# EAGLE design pic socket (EAGLE 9.6.1)
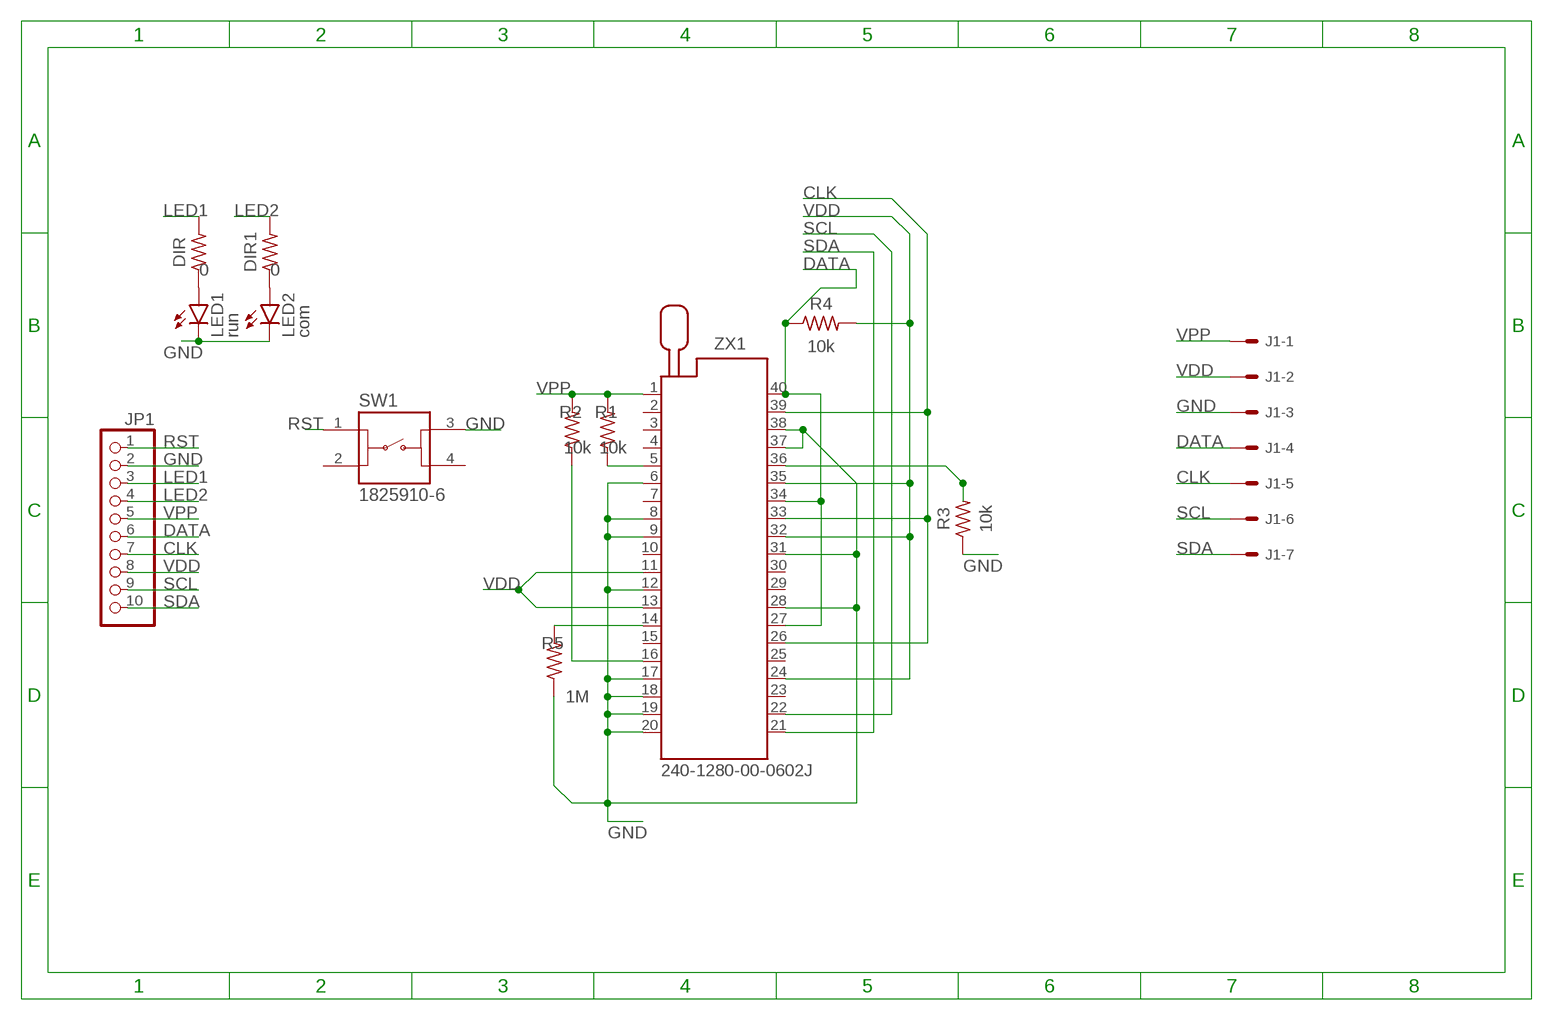
[diagram p0: schematic, sheet 1]

## Parts
DIR  0  R-US_CHIP-1206(3216-METRIC)  [RESC3216X70]
DIR1  0  R-US_CHIP-1206(3216-METRIC)  [RESC3216X70]
J1  22-05-7078-07  [7395-07]
JP1  PINHD-1X10  [1X10]
LED1  run  LEDSMT1206  [1206]
LED2  com  LEDSMT1206  [1206]
R1  10k  R-US_CHIP-1206(3216-METRIC)  [RESC3216X70]
R2  10k  R-US_CHIP-1206(3216-METRIC)  [RESC3216X70]
R3  10k  R-US_CHIP-1206(3216-METRIC)  [RESC3216X70]
R4  10k  R-US_CHIP-1206(3216-METRIC)  [RESC3216X70]
R5  1M  R-US_CHIP-1206(3216-METRIC)  [RESC3216X70]
SW1  1825910-6  [1825910-6]
ZX1  240-1280-00-0602J  [240-1280-00-0602J]

## Nets
CLK: J1.5 JP1.7 ZX1.26 ZX1.33 ZX1.39
DATA: J1.4 JP1.6 R4.1 ZX1.27 ZX1.34 ZX1.40
GND: J1.3 JP1.2 LED1.C LED2.C R3.1 R5.1 SW1.3 ZX1.6 ZX1.8 ZX1.9 ZX1.12 ZX1.17 ZX1.18 ZX1.19 ZX1.20 ZX1.28 ZX1.31 ZX1.37 ZX1.38
LED1: DIR.2 JP1.3
LED2: DIR1.2 JP1.4
N$1: R3.2 ZX1.36
N$2: R1.1 ZX1.5
N$3: R2.1 ZX1.16
N$4: R5.2 ZX1.14
N$5: DIR.1 LED1.A
N$6: DIR1.1 LED2.A
RST: JP1.1 SW1.1
SCL: J1.6 JP1.9 ZX1.22
SDA: J1.7 JP1.10 ZX1.21
VDD: J1.2 JP1.8 R4.2 ZX1.11 ZX1.13 ZX1.24 ZX1.32 ZX1.35
VPP: J1.1 JP1.5 R1.2 R2.2 ZX1.1
Unconnected: SW1.2 SW1.4 ZX1.2 ZX1.3 ZX1.4 ZX1.7 ZX1.10 ZX1.15 ZX1.23 ZX1.25 ZX1.29 ZX1.30

## Library data of the parts
DIR DIR1 R1-R5 = Resistor:R-US: Resistor Fixed - ANSI; CATEGORY: Resistor; SUB-CATEGORY: Fixed
J1 = con-molex:22-?-07: CONNECTOR wire to board 2.54 mm (.1 inch) pitch header; MF: MOLEX; OC_FARNELL: unknown; OC_NEWARK: unknown
JP1 = pinhead:PINHD-1X10: PIN HEADER
LED1 LED2 = led:LED: LED OSRAM: - CHIPLED LG R971, LG N971, LY N971, LG Q971, LY Q971, LO R971, LY R971 LH N974, LH R974 LS Q976, LO Q976, LY Q976 LO Q996 - Hyper CHIPLED LW Q18S LB Q993, LB Q99A, LB R99A - SideLED LS A670, LO A670, LY A670, LG A670, LP A670 LB A673, LV A673, LT A673, LW A673 LH A674 LY A675 LS A676, LA A676, LO A676, LY A676, LW A676 LS A679, LY A679, LG A679 - Hyper Micro SIDELED® LS Y876, LA Y876, LO Y876, LY Y876 LT Y87S - SmartLED LW L88C, LW L88S LB L89C, LB L89S, LG L890 LS L89K, LO L89K, LY L89K LS L896, LA L896, LO L896, LY L896 - TOPLED LS T670, LO T670, LY T670, LG T670, LP T670 LSG T670, LSP T670, LSY T670, LOP T670, LYG T670 LG T671, LOG T671, LSG T671 LB T673, LV T673, LT T673, LW T673 LH T674 LS T676, LA T676, LO T676, LY T676, LB T676, LH T676, LSB T676, LW T676 LB T67C, LV T67C, LT T67C, LS T67K, LO T67K, LY T67K, LW E67C LS E67B, LA E67B, LO E67B, LY E67B, LB E67C, LV E67C, LT E67C LW T67C LS T679, LY T679, LG T679 LS T770, LO T770, LY T770, LG T770, LP T770 LB T773, LV T773, LT T773, LW T773 LH T774 LS E675, LA E675, LY E675, LS T675 LS T776, LA T776, LO T776, LY T776, LB T776 LHGB T686 LT T68C, LB T68C - Hyper Mini TOPLED® LB M676 - Mini TOPLED Santana® LG M470 LS M47K, LO M47K, LY M47K Source: http://www.osram.convergy.de LUXEON: - LUMILED® LXK2-PW12-R00, LXK2-PW12-S00, LXK2-PW14-U00, LXK2-PW14-V00 LXK2-PM12-R00, LXK2-PM12-S00, LXK2-PM14-U00 LXK2-PE12-Q00, LXK2-PE12-R00, LXK2-PE12-S00, LXK2-PE14-T00, LXK2-PE14-U00 LXK2-PB12-K00, LXK2-PB12-L00, LXK2-PB12-M00, LXK2-PB14-N00, LXK2-PB14-P00, LXK2-PB14-Q00 LXK2-PR12-L00, LXK2-PR12-M00, LXK2-PR14-Q00, LXK2-PR14-R00 LXK2-PD12-Q00, LXK2-PD12-R00, LXK2-PD12-S00 LXK2-PH12-R00, LXK2-PH12-S00 LXK2-PL12-P00, LXK2-PL12-Q00, LXK2-PL12-R00 Source: www.luxeon.com KINGBRIGHT: KA-3528ASYC Source: www.kingbright.com
SW1 = Switch:1825910-6: SWITCH TACTILE SPST-NO 0.05A 24V Manufacturer's datasheet <https://www.te.com/commerce/DocumentDelivery/DDEController?Action=srchrtrv&DocNm=1825910&DocType=Customer+Drawing&DocLang=English>; CREATED_BY: PCBLayout.com; DIGIKEY_PART_NUMBER: 450-1650-ND; MANUFACTURER: TE Connectivity ALCOSWITCH Switches; MPN: 1825910-6
ZX1 = con-3m:240-?-00-0602J: Zero Insertion Force Socked Source: http://www.3M.com/ehpd; MF: 3M; MPN: 240-1280-00-0602J; OC_FARNELL: 9897364; OC_NEWARK: 85K7848

## Net classes
0 default: width 0.406 mm, clearance 0.305 mm

## Board
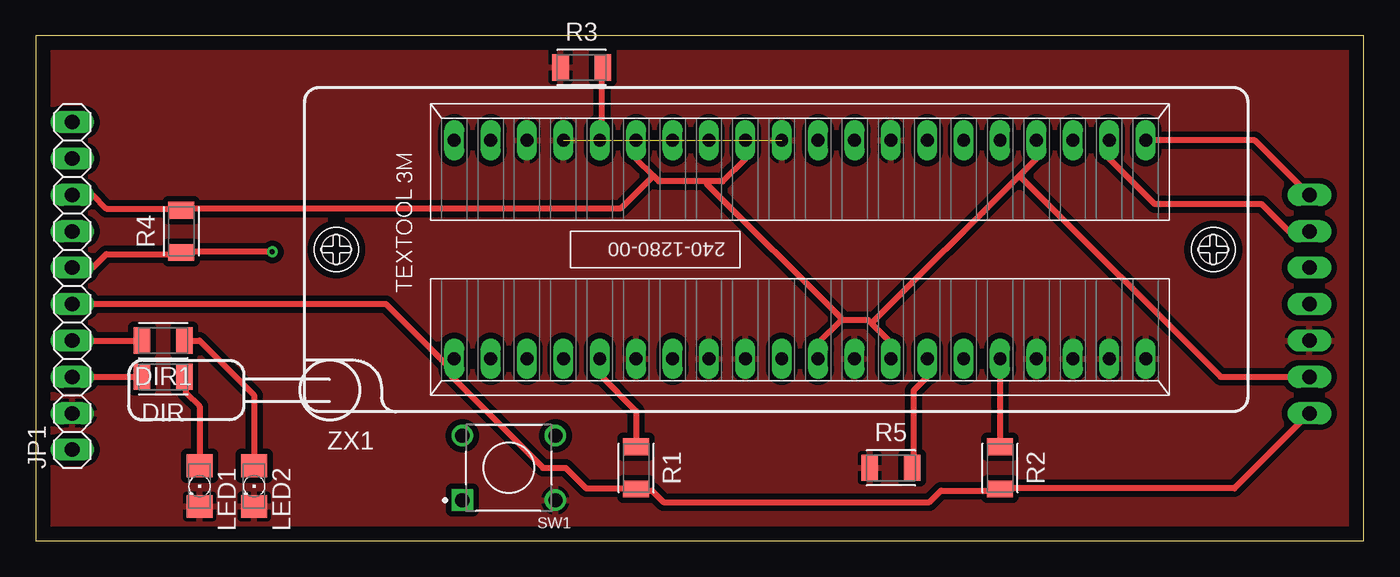
[diagram p1: board, top side]
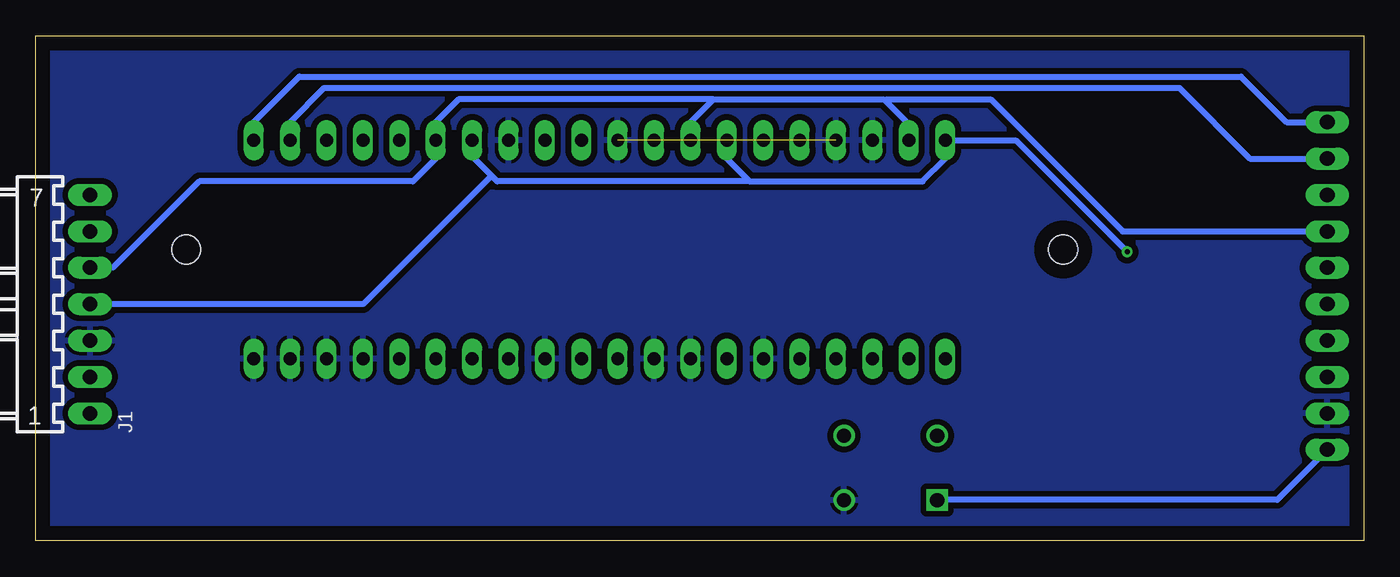
[diagram p2: board, bottom side, seen from below]

Size 92.69 x 35.23 mm. Coordinates in mm from the lower left corner, seen from the top.
Outline: 0,0 92.69,0 92.69,35.23 0,35.23 0,0
Copper layers (1*16): Top 0.035mm / dielectric 1.5mm / Bottom 0.035mm
Design rules "default": minimum track width 6mil, minimum drill 0.35mm, track to track 6mil, track to pad 6mil, pad to pad 6mil, via to via 6mil, smd to smd 6mil, copper to edge 40mil, drill to drill 6mil, minimum pad ring 10mil, minimum via ring 8mil, stop-mask expansion 4mil, vias tented up to drill 0mil, thermal gap 10mil

### Footprints (pad centres in the part's own frame; a part is rotated, then mirrored left to right if it is on the bottom)
RESC3216X70 = smd 1.165 x 1.815: 1 -1.475,0; 2 1.475,0
7395-07 = drill 1.016 long: 1 7.62,0; 2 5.08,0; 3 2.54,0; 4 0,0; 5 -2.54,0; 6 -5.08,0; 7 -7.62,0
1X10 = drill 1.016 long: 1 -11.43,0; 2 -8.89,0; 3 -6.35,0; 4 -3.81,0; 5 -1.27,0; 6 1.27,0; 7 3.81,0; 8 6.35,0; 9 8.89,0; 10 11.43,0
1206 = smd 1.6 x 1.803: A -1.422,0; C 1.422,0
1825910-6 = drill 0.99 square: 1 3.25,2.25 | drill 0.99: 2 3.25,-2.25; 3 -3.25,2.25; 4 -3.25,-2.25
240-1280-00-0602J = drill 0.9 long: 1 -24.13,-7.62; 2 -21.59,-7.62; 3 -19.05,-7.62; 4 -16.51,-7.62; 5 -13.97,-7.62; 6 -11.43,-7.62; 7 -8.89,-7.62; 8 -6.35,-7.62; 9 -3.81,-7.62; 10 -1.27,-7.62; 11 1.27,-7.62; 12 3.81,-7.62; 13 6.35,-7.62; 14 8.89,-7.62; 15 11.43,-7.62; 16 13.97,-7.62; 17 16.51,-7.62; 18 19.05,-7.62; 19 21.59,-7.62; 20 24.13,-7.62; 21 24.13,7.62; 22 21.59,7.62; 23 19.05,7.62; 24 16.51,7.62; 25 13.97,7.62; 26 11.43,7.62; 27 8.89,7.62; 28 6.35,7.62; 29 3.81,7.62; 30 1.27,7.62; 31 -1.27,7.62; 32 -3.81,7.62; 33 -6.35,7.62; 34 -8.89,7.62; 35 -11.43,7.62; 36 -13.97,7.62; 37 -16.51,7.62; 38 -19.05,7.62; 39 -21.59,7.62; 40 -24.13,7.62 | hole 2: 28.86,0; -32.36,0

### Placement (x,y rotation side)
DIR  8.89,11.43 180 top
DIR1  8.89,13.97 180 top
J1  88.9,16.51 270 bottom
JP1  2.54,17.78 90 top
LED1  11.43,3.81 270 top
LED2  15.24,3.81 270 top
R1  41.91,5.08 270 top
R2  67.31,5.08 270 top
R3  38.1,33.02 0 top
R4  10.16,21.59 90 top
R5  59.69,5.08 0 top
SW1  33.02,5.08 180 top
ZX1  53.34,20.32 0 top

### Tracks (layer width: path | path; a pad name or v marks a point on that pad's centre or on a via)
CLK
  Bottom 0.406: ZX1.39 31.75,29.05 33.42,30.72 | 33.42,30.72 33.5,30.8 45.4,30.8 | 45.4,30.8 46.99,29.21 ZX1.33 | 45.4,30.8 63.18,30.8 64.77,29.21 ZX1.26 64.77,26.67 66.36,25.08 81.28,25.08 87.31,19.05 J1.5 | JP1.7 16.83,21.59 26.03,30.8 33.34,30.8 33.42,30.72
DATA  (via drill 0.35)
  Top 0.406: JP1.6 3.97,19.05 4.92,20 10.16,20 R4.1 10.32,20.16 v16.51,20.16
  Bottom 0.406: 42.86,25.08 30.8,25.08 29.21,26.67 ZX1.40 24.29,27.94 v16.51,20.16 | 42.86,25.08 44.45,26.67 ZX1.34 | ZX1.27 62.23,26.83 60.88,25.48 | 60.88,25.48 60.48,25.08 42.86,25.08 | J1.4 69.85,16.51 60.88,25.48
GND  (1 unrouted)
  pour Top (isolate 0.406): -1.27,35.56 -1.27,0 0,-1.27 93.98,-1.27 95.25,0 95.25,34.29 92.71,36.83 0,36.83
  pour Bottom (isolate 0.406): -1.27,35.56 -1.27,1.27 0,0 92.71,0 92.71,35.56 91.44,36.83 -1.27,36.83
  pour Bottom (isolate 1.016): 0,35.56 0,0 92.71,0 92.71,35.56
  pour Top (isolate 1.016): 0,35.56 0,0 92.71,0 92.71,35.56
LED1
  Top 0.406: JP1.3 DIR.2
LED2
  Top 0.406: JP1.4 DIR1.2
N$1
  Top 0.406: ZX1.36 39.53,28.1 39.53,33.02 R3.2
N$2
  Top 0.406: R1.1 41.91,9.05 39.37,11.59 ZX1.5
N$3
  Top 0.406: ZX1.16 R2.1
N$4
  Top 0.406: ZX1.14 62.23,11.43 61.28,10.48 61.28,5.08 R5.2
N$5
  Top 0.406: LED1.A 11.43,9.37 10.48,10.32 10.48,11.43 DIR.1
N$6
  Top 0.406: LED2.A 15.24,10.16 11.43,13.97 DIR1.1
RST
  Bottom 0.406: JP1.1 6.03,2.86 29.69,2.86 SW1.1
SCL
  Top 0.406: ZX1.22 74.93,26.67 78.11,23.5 85.57,23.5 87.47,21.59 J1.6
  Bottom 0.406: JP1.9 7.94,26.67 12.86,31.59 72.55,31.59 74.93,29.21 ZX1.22
SDA
  Top 0.406: ZX1.21 85.09,27.94 J1.7
  Bottom 0.406: JP1.10 5.4,29.21 8.57,32.38 74.3,32.38 77.47,29.21 ZX1.21
VDD
  Top 0.406: ZX1.11 54.61,13.81 56.2,15.4 | 56.2,15.4 58.1,15.4 58.34,15.16 | 58.34,15.16 59.69,13.81 ZX1.13 | ZX1.24 69.85,26.67 68.66,25.48 | 58.34,15.16 68.66,25.48 | J1.2 82.71,11.43 68.66,25.48 | JP1.8 3.97,24.13 4.92,23.18 10.16,23.18 R4.2 10.32,23.18 40.8,23.18 43.1,25.48 | ZX1.35 41.91,26.67 43.1,25.48 | 43.1,25.48 43.5,25.08 46.83,25.08 | 46.83,25.08 47.94,25.08 49.53,26.67 ZX1.32 | 56.2,15.4 56.2,15.56 46.83,24.92 46.83,25.08
VPP
  Top 0.406: J1.1 83.66,3.65 67.31,3.65 R2.2 67.15,3.49 63.18,3.49 62.39,2.7 43.82,2.7 43.02,3.49 42.07,3.49 R1.2 41.91,3.65 38.42,3.65 36.99,5.08 35.4,5.08 29.05,11.43 29.05,12.54 ZX1.1 28.89,12.06 24.45,16.51 JP1.5